# EAGLE schematic v8g (EAGLE 9.0.1)

## Sheet 1 of 4
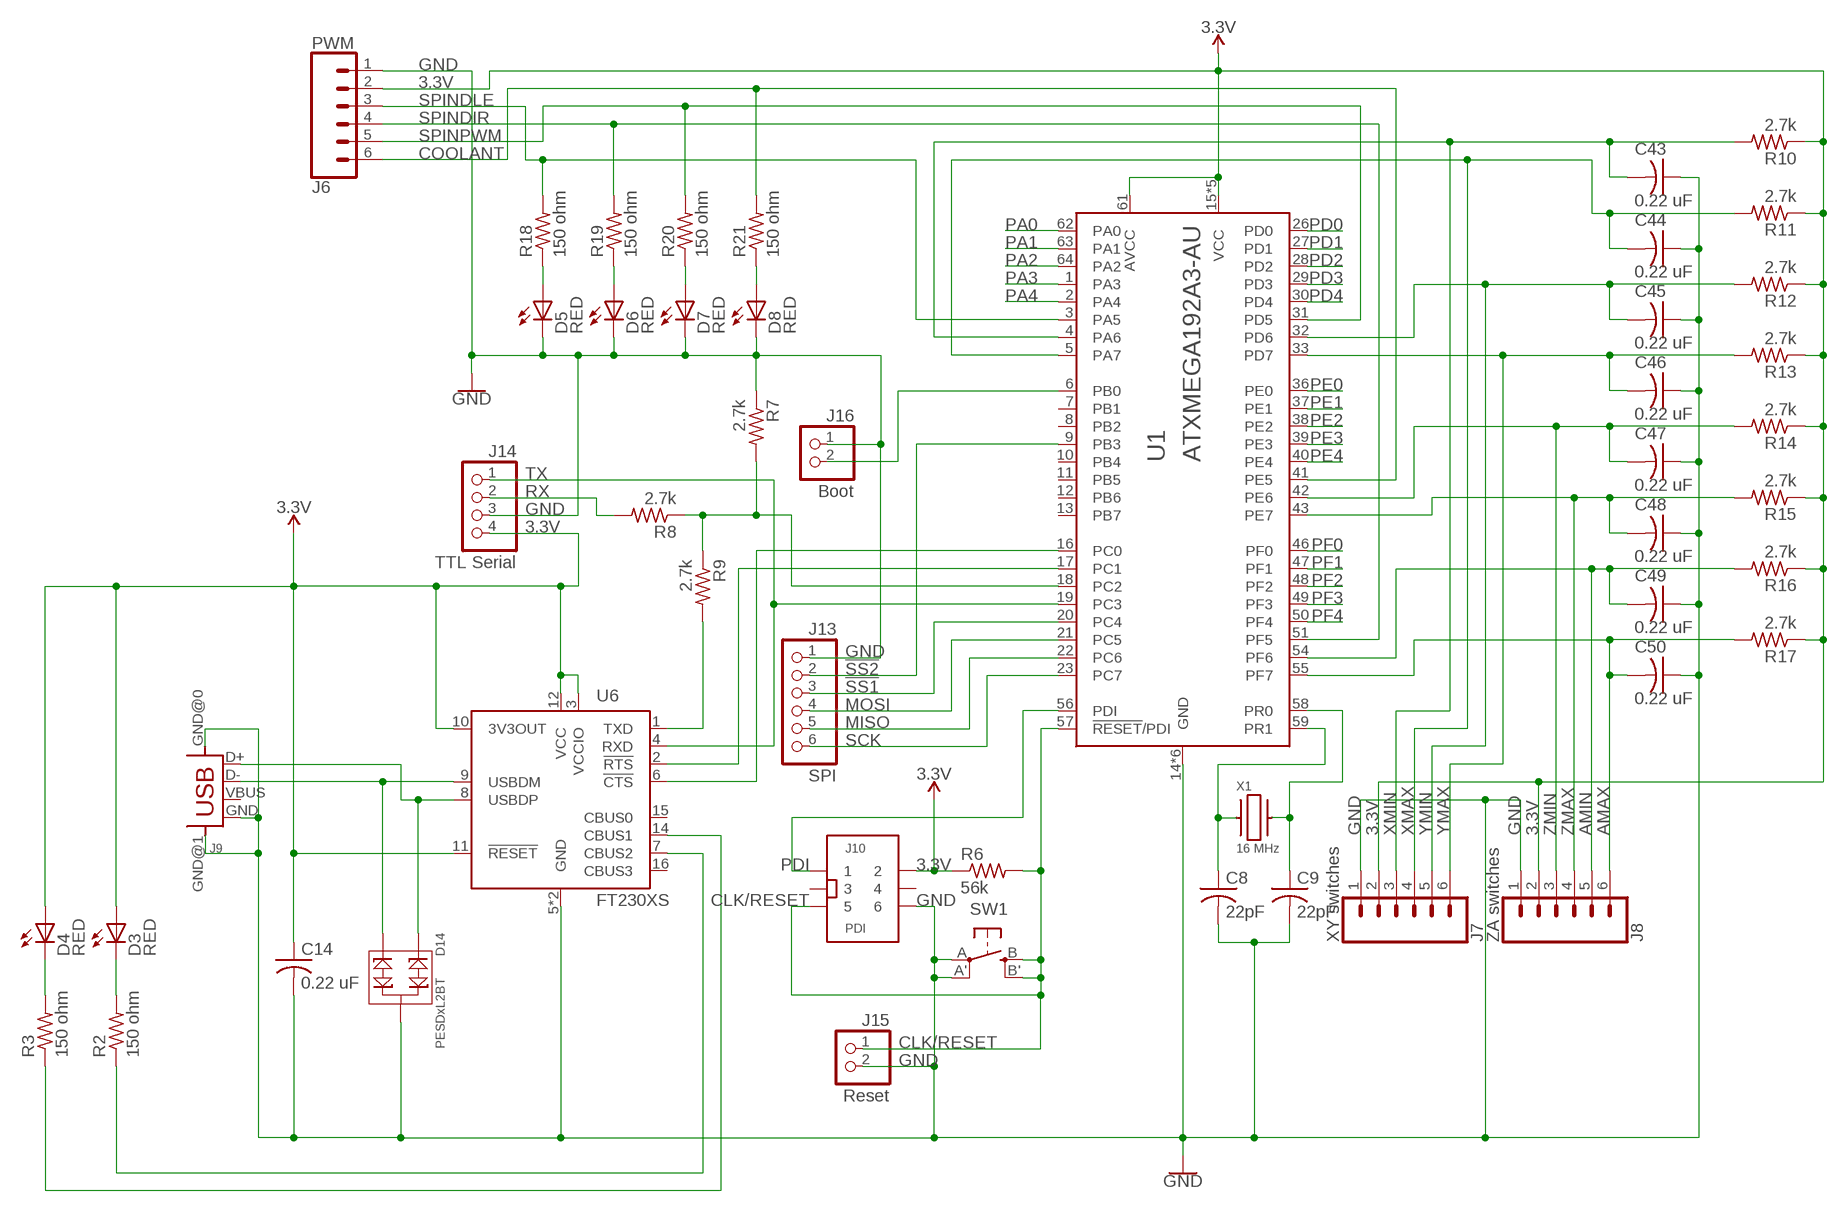
[diagram p0: schematic, sheet 1]

### Parts
C8  22pF  C-USC1206  [C1206]
C9  22pF  C-USC1206  [C1206]
C14  0.22 uF  C-USC1206  [C1206]
C43  0.22 uF  C-USC1206  [C1206]
C44  0.22 uF  C-USC1206  [C1206]
C45  0.22 uF  C-USC1206  [C1206]
C46  0.22 uF  C-USC1206  [C1206]
C47  0.22 uF  C-USC1206  [C1206]
C48  0.22 uF  C-USC1206  [C1206]
C49  0.22 uF  C-USC1206  [C1206]
C50  0.22 uF  C-USC1206  [C1206]
D3  RED  LEDCHIPLED_1206  [CHIPLED_1206]
D4  RED  LEDCHIPLED_1206  [CHIPLED_1206]
D5  RED  LEDCHIPLED_1206  [CHIPLED_1206]
D6  RED  LEDCHIPLED_1206  [CHIPLED_1206]
D7  RED  LEDCHIPLED_1206  [CHIPLED_1206]
D8  RED  LEDCHIPLED_1206  [CHIPLED_1206]
D14  PESDxL2BT  D-ESD-PESDXL2BT  [SOT23]
J6  PWM  CONN_063.5MM-6  [SCREWTERMINAL-3.5MM-6]
J7  XY switches  CONN_063.5MM-6  [SCREWTERMINAL-3.5MM-6]
J8  ZA switches  CONN_063.5MM-6  [SCREWTERMINAL-3.5MM-6]
J9  USB  USB-B-H  [USB-B-H]
J10  PDI  IDC-6-PIN-61200621621  [IDC-6-PIN-61200621621]
J13  SPI  PINHD-1X6  [1X06]
J14  TTL Serial  PINHD-1X4  [1X04]
J15  Reset  PINHD-1X2  [1X02]
J16  Boot  PINHD-1X2  [1X02]
R2  150 ohm  R-US_M1206  [M1206]
R3  150 ohm  R-US_M1206  [M1206]
R6  56k  R-US_M1206  [M1206]
R7  2.7k  R-US_M1206  [M1206]
R8  2.7k  R-US_M1206  [M1206]
R9  2.7k  R-US_M1206  [M1206]
R10  2.7k  R-US_M1206  [M1206]
R11  2.7k  R-US_M1206  [M1206]
R12  2.7k  R-US_M1206  [M1206]
R13  2.7k  R-US_M1206  [M1206]
R14  2.7k  R-US_M1206  [M1206]
R15  2.7k  R-US_M1206  [M1206]
R16  2.7k  R-US_M1206  [M1206]
R17  2.7k  R-US_M1206  [M1206]
R18  150 ohm  R-US_M1206  [M1206]
R19  150 ohm  R-US_M1206  [M1206]
R20  150 ohm  R-US_M1206  [M1206]
R21  150 ohm  R-US_M1206  [M1206]
SW1  SPST_TACT-EVQQ2  [EVQ-Q2]
U1  ATXMEGA192A3-AU  [TQFP-64A-64]
U6  FT230XS  [SSOP16]
X1  16 MHz  C4STSMD  [C4ST-SMD]

### Nets
3.3V: C14.1 D3.A D4.A J6.2 J7.2 J8.2 J10.2 J14.4 R6.1 R10.1 R11.1 R12.1 R13.1 R14.1 R15.1 R16.1 R17.1 U1.15(VCC) U1.25(VCC) U1.35(VCC) U1.45(VCC) U1.53(VCC) U1.61(AVCC) U6.3(VCCIO) U6.10(3V3OUT) U6.11(!RESET) U6.12(VCC) ; also sheet 2,3,4
!SS1: J13.3 U1.20(PC4)
!SS2: J13.2 U1.9(PB3)
AMAX: C50.2 J8.6 R17.2 U1.55(PF7)
AMIN: C49.2 J8.5 R16.2 U1.54(PF6)
CLK/RESET: J10.5 J15.1 R6.2 SW1.B'(S1) SW1.B(S) U1.57(!RESET!/PDI)
COOLANT: J6.6 R21.2 U1.41(PE5)
GND: C8.2 C9.2 C14.2 C43.1 C44.1 C45.1 C46.1 C47.1 C48.1 C49.1 C50.1 D5.C D6.C D7.C D8.C D14.3 J6.1 J7.1 J8.1 J9.GND J9.GND@0(GND) J9.GND@1(GND) J10.6 J13.1 J14.3 J15.2 J16.1 R7.1 SW1.A'(P1) SW1.A(P) U1.14(GND) U1.24(GND) U1.34(GND) U1.44(GND) U1.52(GND) U1.60(GND) U6.5(GND) U6.13(GND) ; also sheet 2,3,4
MISO: J13.5 U1.22(PC6)
MOSI: J13.4 U1.21(PC5)
N$1: R9.2 U6.1(TXD)
N$2: D14.2 J9.D- U6.9(USBDM)
N$4: R3.1 U6.14(CBUS1)
N$6: J16.2 U1.6(PB0)
N$7: D5.A R18.1
N$8: D6.A R19.1
N$9: D7.A R20.1
N$10: D8.A R21.1
N$11: R2.1 U6.7(CBUS2)
N$12: U1.16(PC0) U6.6(!CTS)
N$13: U1.17(PC1) U6.2(!RTS)
N$14: R7.2 R8.1 R9.1 U1.18(PC2)
N$15: D14.1 J9.D+ U6.8(USBDP)
N$17: D3.C R2.2
N$18: D4.C R3.2
N$68: C8.1 U1.59(PR1) X1.1
N$69: C9.1 U1.58(PR0) X1.2
PA0: U1.62(PA0) ; also sheet 3
PA1: U1.63(PA1) ; also sheet 3
PA2: U1.64(PA2) ; also sheet 3
PA3: U1.1(PA3) ; also sheet 3
PA4: U1.2(PA4) ; also sheet 3
PD0: U1.26(PD0) ; also sheet 4
PD1: U1.27(PD1) ; also sheet 4
PD2: U1.28(PD2) ; also sheet 4
PD3: U1.29(PD3) ; also sheet 4
PD4: U1.30(PD4) ; also sheet 4
PDI: J10.1 U1.56(PDI)
PE0: U1.36(PE0) ; also sheet 4
PE1: U1.37(PE1) ; also sheet 4
PE2: U1.38(PE2) ; also sheet 4
PE3: U1.39(PE3) ; also sheet 4
PE4: U1.40(PE4) ; also sheet 4
PF0: U1.46(PF0) ; also sheet 3
PF1: U1.47(PF1) ; also sheet 3
PF2: U1.48(PF2) ; also sheet 3
PF3: U1.49(PF3) ; also sheet 3
PF4: U1.50(PF4) ; also sheet 3
RX: J14.2 R8.2
SCK: J13.6 U1.23(PC7)
SPINDIR: J6.4 R19.2 U1.51(PF5)
SPINDLE: J6.3 R18.2 U1.3(PA5)
SPINPWM: J6.5 R20.2 U1.31(PD5)
TX: J14.1 U1.19(PC3) U6.4(RXD)
XMAX: C44.2 J7.4 R11.2 U1.5(PA7)
XMIN: C43.2 J7.3 R10.2 U1.4(PA6)
YMAX: C46.2 J7.6 R13.2 U1.33(PD7)
YMIN: C45.2 J7.5 R12.2 U1.32(PD6)
ZMAX: C48.2 J8.4 R15.2 U1.43(PE7)
ZMIN: C47.2 J8.3 R14.2 U1.42(PE6)
Unconnected: J9.VBUS J10.3 J10.4 U1.7(PB1) U1.8(PB2) U1.10(PB4) U1.11(PB5) U1.12(PB6) U1.13(PB7) U6.15(CBUS0) U6.16(CBUS3)

## Sheet 2 of 4
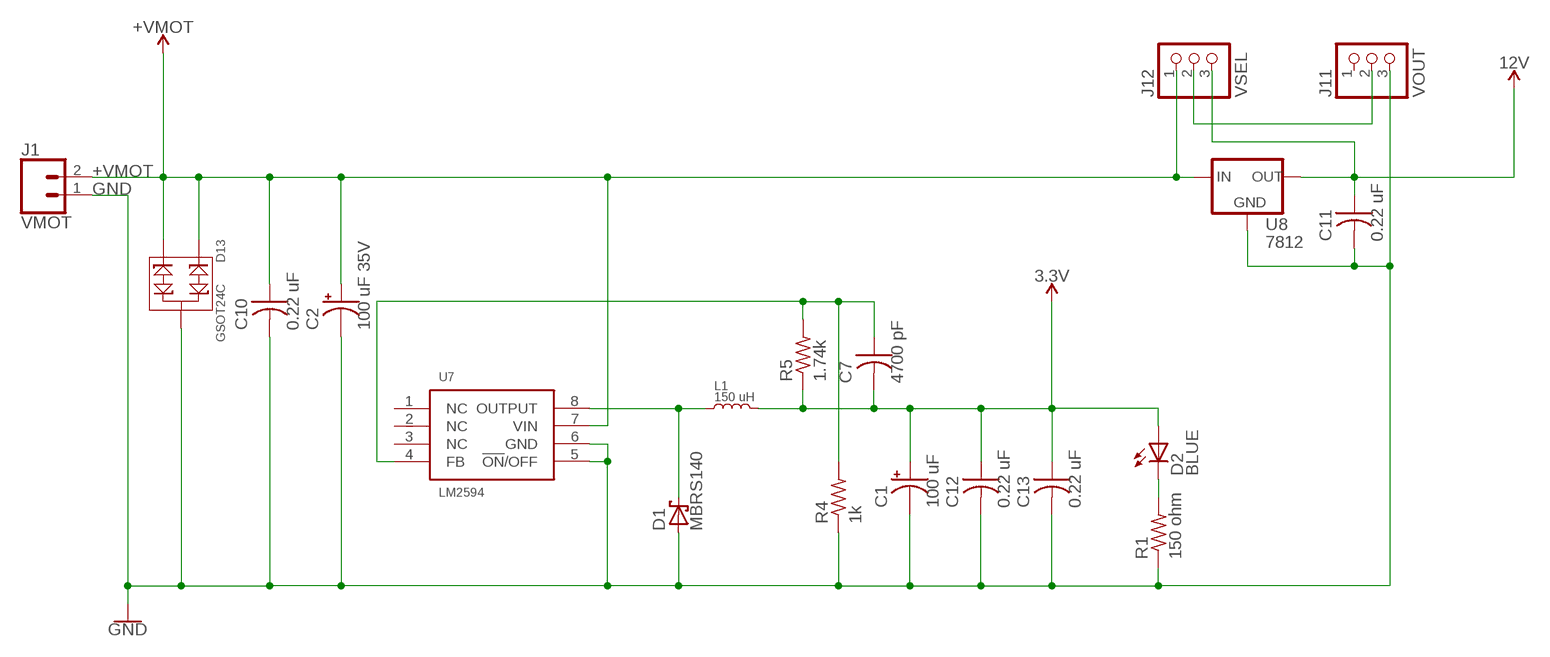
[diagram p1: schematic, sheet 2]

### Parts
C1  100 uF  CPOL-US  [WCAP-ASLI]
C2  100 uF 35V  CPOL-US  [WCAP-ASLI]
C7  4700 pF  C-USC1206  [C1206]
C10  0.22 uF  C-USC1206  [C1206]
C11  0.22 uF  C-USC1206  [C1206]
C12  0.22 uF  C-USC1206  [C1206]
C13  0.22 uF  C-USC1206  [C1206]
D1  MBRS140  SHOTTKY-DIODESMBRS140  [DO-214AA]
D2  BLUE  LEDCHIPLED_1206  [CHIPLED_1206]
D13  GSOT24C  D-ESD-PESDXL2BT  [SOT23]
J1  VMOT  CONN_025MM  [SCREWTERMINAL-5MM-2]
J11  VOUT  PINHD-1X3  [1X03]
J12  VSEL  PINHD-1X3  [1X03]
L1  150 uH  SDE0805A-471K  [SDE0805A]
R1  150 ohm  R-US_R1206  [R1206]
R4  1k  R-US_R1206  [R1206]
R5  1.74k  R-US_R1206  [R1206]
U7  LM2594  [SOIC-8_NB]
U8  7812  L78XXD2TT  [D2PAK]

### Nets
3.3V: C1.+ C7.2 C12.1 C13.1 D2.A L1.2 R5.1 ; also sheet 1,3,4
12V: C11.1 J12.3 U8.3(OUT)
+VMOT: C2.+ C10.1 D13.1 D13.2 J1.2 J12.1 U7.7(VIN) U8.1(IN) ; also sheet 3,4
GND: C1.- C2.- C10.2 C11.2 C12.2 C13.2 D1.A D13.3 J1.1 J11.3 R1.1 R4.1 U7.5(!ON!/OFF) U7.6(GND) U8.2(GND) ; also sheet 1,3,4
N$3: D2.C R1.2
N$16: J11.2 J12.2
N$21: D1.C L1.1 U7.8(OUTPUT)
N$23: C7.1 R4.2 R5.2 U7.4(FB)
Unconnected: J11.1 U7.1(NC) U7.2(NC) U7.3(NC)

## Sheet 3 of 4
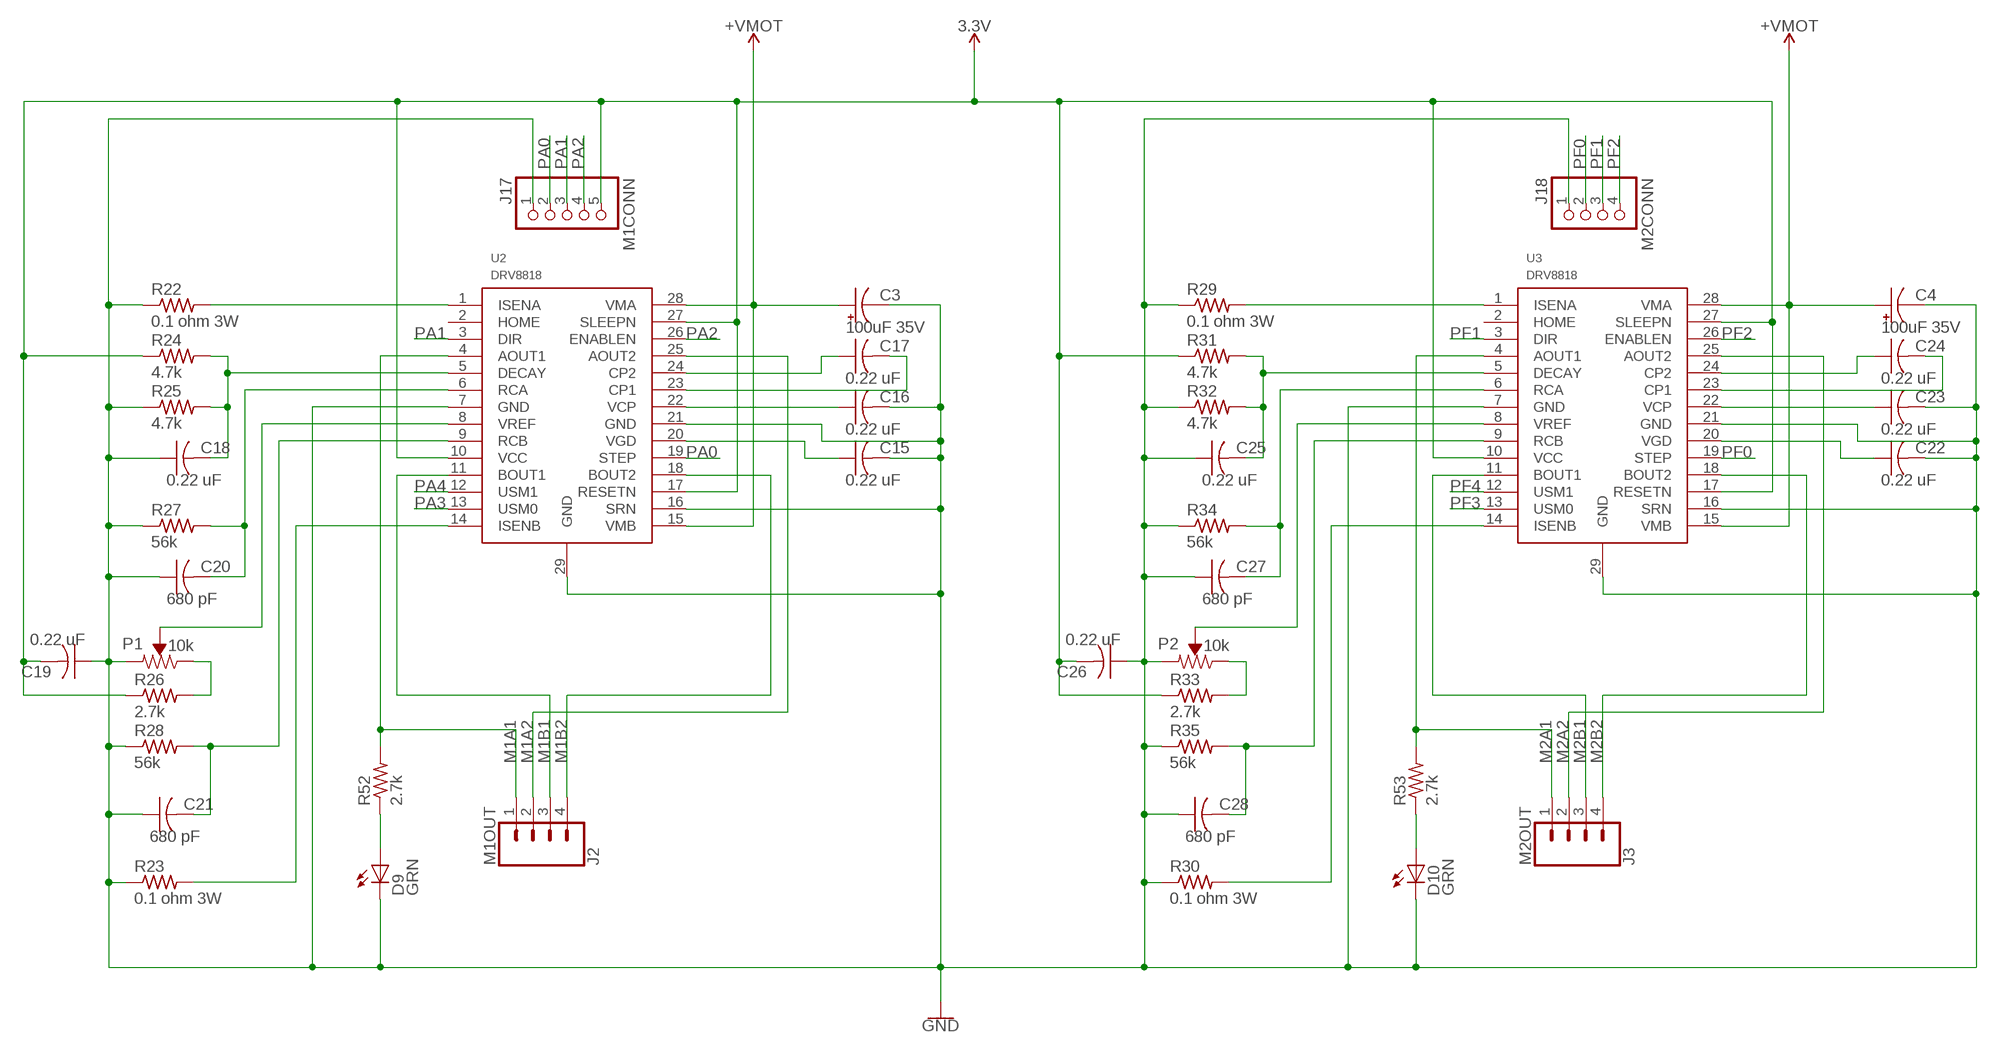
[diagram p2: schematic, sheet 3]

### Parts
C3  100uF 35V  CPOL-US  [WCAP-ASLI]
C4  100uF 35V  CPOL-US  [WCAP-ASLI]
C15  0.22 uF  C-USC1206  [C1206]
C16  0.22 uF  C-USC1206  [C1206]
C17  0.22 uF  C-USC1206  [C1206]
C18  0.22 uF  C-USC1206  [C1206]
C19  0.22 uF  C-USC1206  [C1206]
C20  680 pF  C-USC1206  [C1206]
C21  680 pF  C-USC1206  [C1206]
C22  0.22 uF  C-USC1206  [C1206]
C23  0.22 uF  C-USC1206  [C1206]
C24  0.22 uF  C-USC1206  [C1206]
C25  0.22 uF  C-USC1206  [C1206]
C26  0.22 uF  C-USC1206  [C1206]
C27  680 pF  C-USC1206  [C1206]
C28  680 pF  C-USC1206  [C1206]
D9  GRN  LEDCHIPLED_1206  [CHIPLED_1206]
D10  GRN  LEDCHIPLED_1206  [CHIPLED_1206]
J2  M1OUT  CONN_04SCREW  [SCREWTERMINAL-3.5MM-4]
J3  M2OUT  CONN_04SCREW  [SCREWTERMINAL-3.5MM-4]
J17  M1CONN  PINHD-1X5  [1X05]
J18  M2CONN  PINHD-1X4  [1X04]
P1  10k  TRIMPOT  [BOURNS_3361P]
P2  10k  TRIMPOT  [BOURNS_3361P]
R22  0.1 ohm 3W  R-US_R2512  [R2512]
R23  0.1 ohm 3W  R-US_R2512  [R2512]
R24  4.7k  R-US_R1206  [R1206]
R25  4.7k  R-US_R1206  [R1206]
R26  2.7k  R-US_R1206  [R1206]
R27  56k  R-US_R1206  [R1206]
R28  56k  R-US_R1206  [R1206]
R29  0.1 ohm 3W  R-US_R2512  [R2512]
R30  0.1 ohm 3W  R-US_R2512  [R2512]
R31  4.7k  R-US_R1206  [R1206]
R32  4.7k  R-US_R1206  [R1206]
R33  2.7k  R-US_R1206  [R1206]
R34  56k  R-US_R1206  [R1206]
R35  56k  R-US_R1206  [R1206]
R52  2.7k  R-US_0207/7  [0207/7]
R53  2.7k  R-US_0207/7  [0207/7]
U2  DRV8818  [HTSSOP_28-PIN]
U3  DRV8818  [HTSSOP_28-PIN]

### Nets
3.3V: C19.2 C26.2 J17.5 R24.1 R26.1 R31.1 R33.1 U2.10(VCC) U2.17(RESETN) U2.27(SLEEPN) U3.10(VCC) U3.17(RESETN) U3.27(SLEEPN) ; also sheet 1,2,4
+VMOT: C3.+ C4.+ U2.15(VMB) U2.28(VMA) U3.15(VMB) U3.28(VMA) ; also sheet 2,4
GND: C3.- C4.- C15.2 C16.2 C18.1 C19.1 C20.1 C21.1 C22.2 C23.2 C25.1 C26.1 C27.1 C28.1 D9.C D10.C J17.1 J18.1 P1.1 P2.1 R22.1 R23.1 R25.1 R27.1 R28.1 R29.1 R30.1 R32.1 R34.1 R35.1 U2.7(GND) U2.16(SRN) U2.21(GND) U2.29(GND) U3.7(GND) U3.16(SRN) U3.21(GND) U3.29(GND) ; also sheet 1,2,4
M1A1: J2.1 R52.2 U2.4(AOUT1)
M1A2: J2.2 U2.25(AOUT2)
M1B1: J2.3 U2.11(BOUT1)
M1B2: J2.4 U2.18(BOUT2)
M2A1: J3.1 R53.2 U3.4(AOUT1)
M2A2: J3.2 U3.25(AOUT2)
M2B1: J3.3 U3.11(BOUT1)
M2B2: J3.4 U3.18(BOUT2)
N$5: D9.A R52.1
N$19: R22.2 U2.1(ISENA)
N$20: P1.2 U2.8(VREF)
N$22: C17.1 U2.24(CP2)
N$24: P1.3 R26.2
N$25: C17.2 U2.23(CP1)
N$27: C18.2 R24.2 R25.2 U2.5(DECAY)
N$28: C20.2 R27.2 U2.6(RCA)
N$30: C21.2 R28.2 U2.9(RCB)
N$31: R23.2 U2.14(ISENB)
N$32: C16.1 U2.22(VCP)
N$34: C15.1 U2.20(VGD)
N$38: R29.2 U3.1(ISENA)
N$39: C25.2 R31.2 R32.2 U3.5(DECAY)
N$40: C27.2 R34.2 U3.6(RCA)
N$42: P2.2 U3.8(VREF)
N$43: P2.3 R33.2
N$44: C28.2 R35.2 U3.9(RCB)
N$45: R30.2 U3.14(ISENB)
N$46: D10.A R53.1
N$47: C24.2 U3.23(CP1)
N$48: C23.1 U3.22(VCP)
N$49: C22.1 U3.20(VGD)
N$50: C24.1 U3.24(CP2)
PA0: J17.2 U2.19(STEP) ; also sheet 1
PA1: J17.3 U2.3(DIR) ; also sheet 1
PA2: J17.4 U2.26(ENABLEN) ; also sheet 1
PA3: U2.13(USM0) ; also sheet 1
PA4: U2.12(USM1) ; also sheet 1
PF0: J18.2 U3.19(STEP) ; also sheet 1
PF1: J18.3 U3.3(DIR) ; also sheet 1
PF2: J18.4 U3.26(ENABLEN) ; also sheet 1
PF3: U3.13(USM0) ; also sheet 1
PF4: U3.12(USM1) ; also sheet 1
Unconnected: U2.2(HOME) U3.2(HOME)

## Sheet 4 of 4
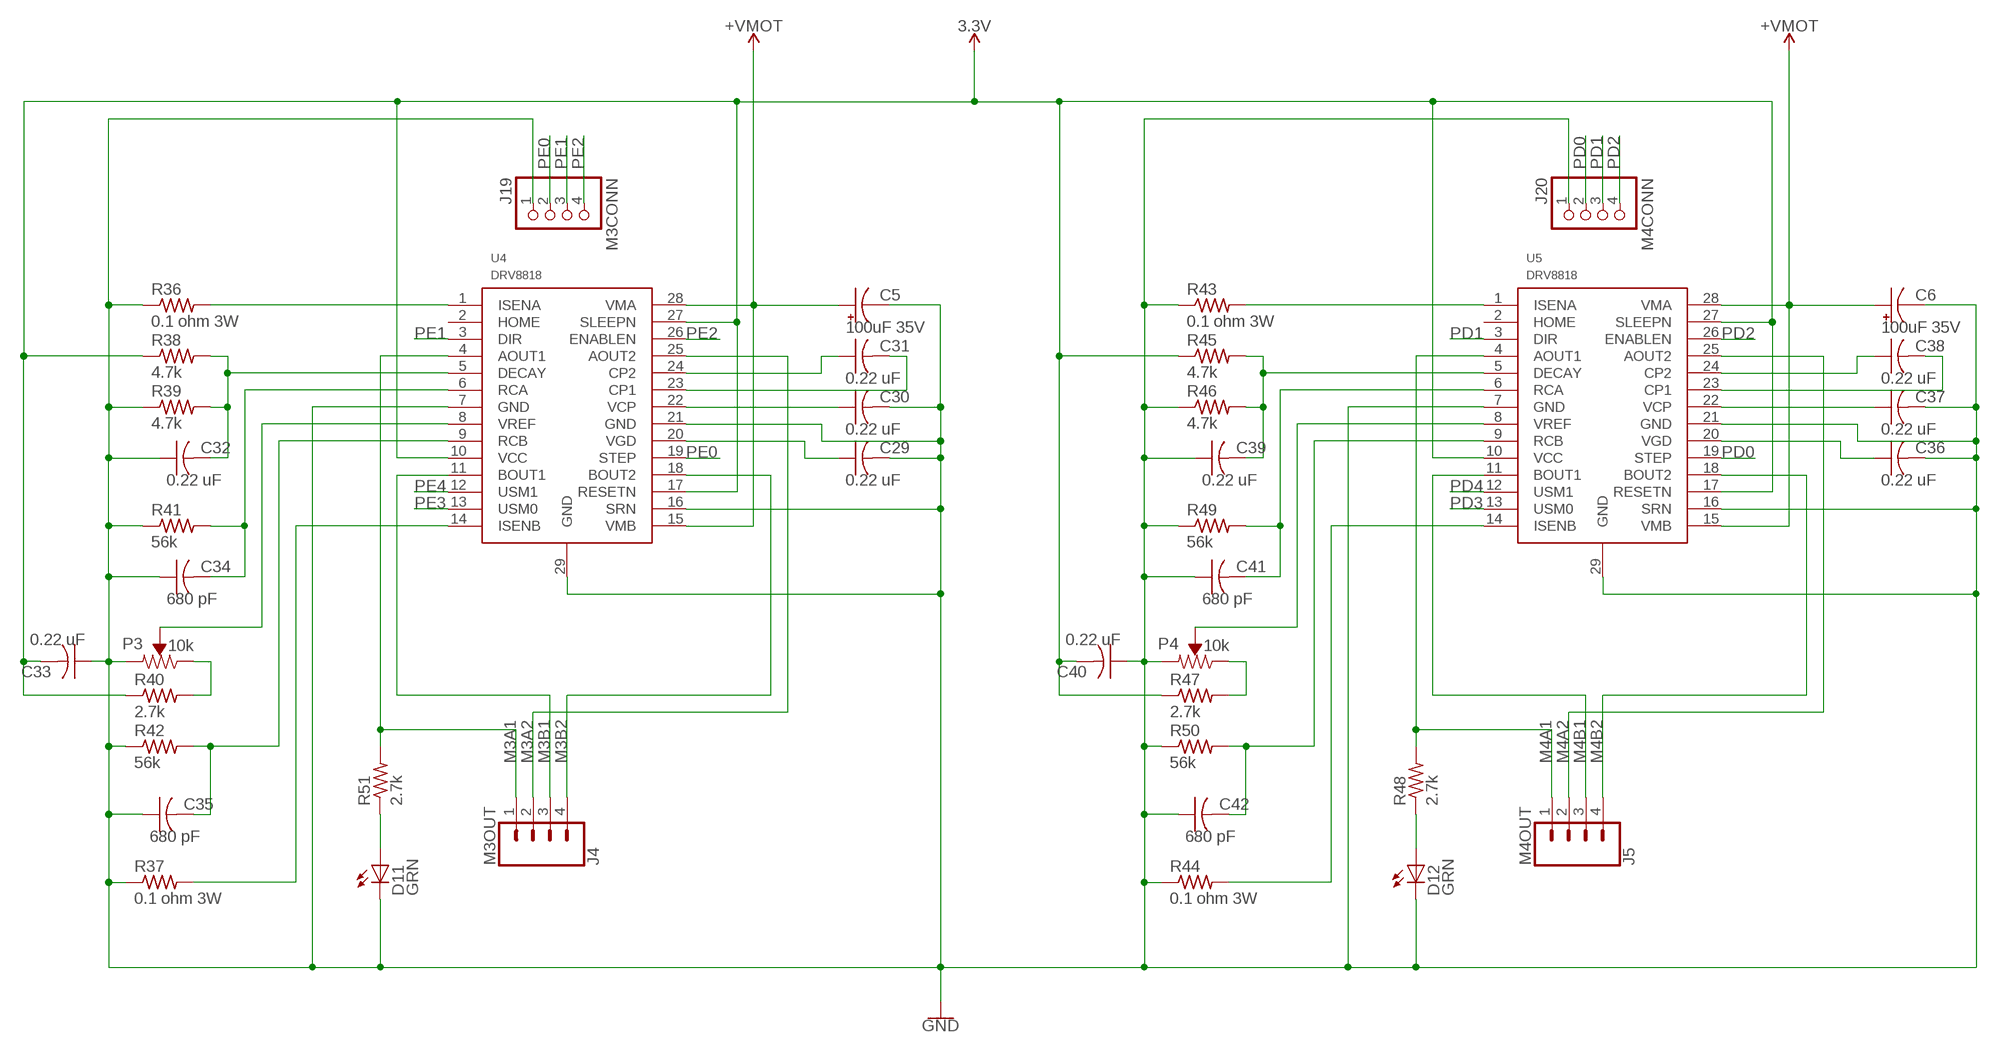
[diagram p3: schematic, sheet 4]

### Parts
C5  100uF 35V  CPOL-US  [WCAP-ASLI]
C6  100uF 35V  CPOL-US  [WCAP-ASLI]
C29  0.22 uF  C-USC1206  [C1206]
C30  0.22 uF  C-USC1206  [C1206]
C31  0.22 uF  C-USC1206  [C1206]
C32  0.22 uF  C-USC1206  [C1206]
C33  0.22 uF  C-USC1206  [C1206]
C34  680 pF  C-USC1206  [C1206]
C35  680 pF  C-USC1206  [C1206]
C36  0.22 uF  C-USC1206  [C1206]
C37  0.22 uF  C-USC1206  [C1206]
C38  0.22 uF  C-USC1206  [C1206]
C39  0.22 uF  C-USC1206  [C1206]
C40  0.22 uF  C-USC1206  [C1206]
C41  680 pF  C-USC1206  [C1206]
C42  680 pF  C-USC1206  [C1206]
D11  GRN  LEDCHIPLED_1206  [CHIPLED_1206]
D12  GRN  LEDCHIPLED_1206  [CHIPLED_1206]
J4  M3OUT  CONN_04SCREW  [SCREWTERMINAL-3.5MM-4]
J5  M4OUT  CONN_04SCREW  [SCREWTERMINAL-3.5MM-4]
J19  M3CONN  PINHD-1X4  [1X04]
J20  M4CONN  PINHD-1X4  [1X04]
P3  10k  TRIMPOT  [BOURNS_3361P]
P4  10k  TRIMPOT  [BOURNS_3361P]
R36  0.1 ohm 3W  R-US_R2512  [R2512]
R37  0.1 ohm 3W  R-US_R2512  [R2512]
R38  4.7k  R-US_R1206  [R1206]
R39  4.7k  R-US_R1206  [R1206]
R40  2.7k  R-US_R1206  [R1206]
R41  56k  R-US_R1206  [R1206]
R42  56k  R-US_R1206  [R1206]
R43  0.1 ohm 3W  R-US_R2512  [R2512]
R44  0.1 ohm 3W  R-US_R2512  [R2512]
R45  4.7k  R-US_R1206  [R1206]
R46  4.7k  R-US_R1206  [R1206]
R47  2.7k  R-US_R1206  [R1206]
R48  2.7k  R-US_0207/7  [0207/7]
R49  56k  R-US_R1206  [R1206]
R50  56k  R-US_R1206  [R1206]
R51  2.7k  R-US_0207/7  [0207/7]
U4  DRV8818  [HTSSOP_28-PIN]
U5  DRV8818  [HTSSOP_28-PIN]

### Nets
3.3V: C33.2 C40.2 R38.1 R40.1 R45.1 R47.1 U4.10(VCC) U4.17(RESETN) U4.27(SLEEPN) U5.10(VCC) U5.17(RESETN) U5.27(SLEEPN) ; also sheet 1,2,3
+VMOT: C5.+ C6.+ U4.15(VMB) U4.28(VMA) U5.15(VMB) U5.28(VMA) ; also sheet 2,3
GND: C5.- C6.- C29.2 C30.2 C32.1 C33.1 C34.1 C35.1 C36.2 C37.2 C39.1 C40.1 C41.1 C42.1 D11.C D12.C J19.1 J20.1 P3.1 P4.1 R36.1 R37.1 R39.1 R41.1 R42.1 R43.1 R44.1 R46.1 R49.1 R50.1 U4.7(GND) U4.16(SRN) U4.21(GND) U4.29(GND) U5.7(GND) U5.16(SRN) U5.21(GND) U5.29(GND) ; also sheet 1,2,3
M3A1: J4.1 R51.2 U4.4(AOUT1)
M3A2: J4.2 U4.25(AOUT2)
M3B1: J4.3 U4.11(BOUT1)
M3B2: J4.4 U4.18(BOUT2)
M4A1: J5.1 R48.2 U5.4(AOUT1)
M4A2: J5.2 U5.25(AOUT2)
M4B1: J5.3 U5.11(BOUT1)
M4B2: J5.4 U5.18(BOUT2)
N$26: R36.2 U4.1(ISENA)
N$29: C32.2 R38.2 R39.2 U4.5(DECAY)
N$33: C34.2 R41.2 U4.6(RCA)
N$35: P3.2 U4.8(VREF)
N$36: P3.3 R40.2
N$37: C35.2 R42.2 U4.9(RCB)
N$41: R37.2 U4.14(ISENB)
N$51: D11.A R51.1
N$52: C31.2 U4.23(CP1)
N$53: C30.1 U4.22(VCP)
N$54: C29.1 U4.20(VGD)
N$55: C31.1 U4.24(CP2)
N$56: R43.2 U5.1(ISENA)
N$57: C39.2 R45.2 R46.2 U5.5(DECAY)
N$58: C41.2 R49.2 U5.6(RCA)
N$59: P4.2 U5.8(VREF)
N$60: P4.3 R47.2
N$61: C42.2 R50.2 U5.9(RCB)
N$62: R44.2 U5.14(ISENB)
N$63: D12.A R48.1
N$64: C38.2 U5.23(CP1)
N$65: C37.1 U5.22(VCP)
N$66: C36.1 U5.20(VGD)
N$67: C38.1 U5.24(CP2)
PD0: J20.2 U5.19(STEP) ; also sheet 1
PD1: J20.3 U5.3(DIR) ; also sheet 1
PD2: J20.4 U5.26(ENABLEN) ; also sheet 1
PD3: U5.13(USM0) ; also sheet 1
PD4: U5.12(USM1) ; also sheet 1
PE0: J19.2 U4.19(STEP) ; also sheet 1
PE1: J19.3 U4.3(DIR) ; also sheet 1
PE2: J19.4 U4.26(ENABLEN) ; also sheet 1
PE3: U4.13(USM0) ; also sheet 1
PE4: U4.12(USM1) ; also sheet 1
Unconnected: U4.2(HOME) U5.2(HOME)

## Library data of the parts
C1-C6 = Pamir:CPOL-US
C7-C50 = adafruit:C-US: CAPACITOR, American symbol
D1 = MarcEagleParts:SHOTTKY-DIODES: Shottky Diodes SMT DO-214AA: 1A 40V SMA 403D-02
D2-D12 = adafruit:LED: LED OSRAM: - CHIPLED LG R971, LG N971, LY N971, LG Q971, LY Q971, LO R971, LY R971 LH N974, LH R974 LS Q976, LO Q976, LY Q976 LO Q996 - Hyper CHIPLED LW Q18S LB Q993, LB Q99A, LB R99A - SideLED LS A670, LO A670, LY A670, LG A670, LP A670 LB A673, LV A673, LT A673, LW A673 LH A674 LY A675 LS A676, LA A676, LO A676, LY A676, LW A676 LS A679, LY A679, LG A679 - Hyper Micro SIDELED® LS Y876, LA Y876, LO Y876, LY Y876 LT Y87S - SmartLED LW L88C, LW L88S LB L89C, LB L89S, LG L890 LS L89K, LO L89K, LY L89K LS L896, LA L896, LO L896, LY L896 - TOPLED LS T670, LO T670, LY T670, LG T670, LP T670 LSG T670, LSP T670, LSY T670, LOP T670, LYG T670 LG T671, LOG T671, LSG T671 LB T673, LV T673, LT T673, LW T673 LH T674 LS T676, LA T676, LO T676, LY T676, LB T676, LH T676, LSB T676, LW T676 LB T67C, LV T67C, LT T67C, LS T67K, LO T67K, LY T67K, LW E67C LS E67B, LA E67B, LO E67B, LY E67B, LB E67C, LV E67C, LT E67C LW T67C LS T679, LY T679, LG T679 LS T770, LO T770, LY T770, LG T770, LP T770 LB T773, LV T773, LT T773, LW T773 LH T774 LS E675, LA E675, LY E675, LS T675 LS T776, LA T776, LO T776, LY T776, LB T776 LHGB T686 LT T68C, LB T68C - Hyper Mini TOPLED® LB M676 - Mini TOPLED Santana® LG M470 LS M47K, LO M47K, LY M47K Source: http://www.osram.convergy.de/
D13 D14 = discrete:D-ESD-PESDXL2BT
J1 = SparkFun-Connectors:CONN_02: Multi connection point. Often used as Generic Header-pin footprint for 0.1 inch spaced/style header connections On any of the 0.1 inch spaced packages, you can populate with these: Break Away Headers - Straight <https://www.sparkfun.com/products/116> (PRT-00116) Break Away Male Headers - Right Angle <https://www.sparkfun.com/products/553> (PRT-00553) Female Headers <https://www.sparkfun.com/products/115> (PRT-00115) Break Away Headers - Machine Pin <https://www.sparkfun.com/products/117> (PRT-00117) Break Away Female Headers - Swiss Machine Pin <https://www.sparkfun.com/products/743> (PRT-00743) For SCREWTERMINALS and SPRING TERMINALS visit here: Screw Terimnals on SparkFun.com <https://www.sparkfun.com/search/results?term=Screw+Terminals> (5mm/3.5mm/2.54mm spacing) This device is also useful as a general connection point to wire up your design to another part of your project. Our various solder wires solder well into these plated through hole pads. Hook-Up Wire - Assortment (Stranded, 22 AWG) <https://www.sparkfun.com/products/11375> (PRT-11375) Hook-Up Wire - Assortment (Solid Core, 22 AWG) <https://www.sparkfun.com/products/11367> (PRT-11367) View the entire wire category on our website here <https://www.sparkfun.com/categories/141> Special notes: Molex polarized connector foot print use with: PRT-08233 with associated crimp pins and housings. 2.54_SCREWTERM for use with PRT-10571. 3.5mm Screw Terminal footprints for PRT-08084 5mm Screw Terminal footprints for use with PRT-08432; SF_SKU: PRT-08432
J2-J5 = SparkFun-Connectors:CONN_04: Multi connection point. Often used as Generic Header-pin footprint for 0.1 inch spaced/style header connections On any of the 0.1 inch spaced packages, you can populate with these: Break Away Headers - Straight <https://www.sparkfun.com/products/116> (PRT-00116) Break Away Male Headers - Right Angle <https://www.sparkfun.com/products/553> (PRT-00553) Female Headers <https://www.sparkfun.com/products/115> (PRT-00115) Break Away Headers - Machine Pin <https://www.sparkfun.com/products/117> (PRT-00117) Break Away Female Headers - Swiss Machine Pin <https://www.sparkfun.com/products/743> (PRT-00743) For SCREWTERMINALS and SPRING TERMINALS visit here: Screw Terimnals on SparkFun.com <https://www.sparkfun.com/search/results?term=Screw+Terminals> (5mm/3.5mm/2.54mm spacing) This device is also useful as a general connection point to wire up your design to another part of your project. Our various solder wires solder well into these plated through hole pads. Hook-Up Wire - Assortment (Stranded, 22 AWG) <https://www.sparkfun.com/products/11375> (PRT-11375) Hook-Up Wire - Assortment (Solid Core, 22 AWG) <https://www.sparkfun.com/products/11367> (PRT-11367) View the entire wire category on our website here <https://www.sparkfun.com/categories/141> Special notes: Molex polarized connector foot print use with SKU : PRT-08231 with associated crimp pins and housings. 1MM SMD Version SKU: PRT-10208; PROD_ID: 2xCONN-08399; SF_ID: 2xPRT-08084
J6-J8 = SparkFun-Connectors:CONN_06: Multi connection point. Often used as Generic Header-pin footprint for 0.1 inch spaced/style header connections On any of the 0.1 inch spaced packages, you can populate with these: Break Away Headers - Straight <https://www.sparkfun.com/products/116> (PRT-00116) Break Away Male Headers - Right Angle <https://www.sparkfun.com/products/553> (PRT-00553) Female Headers <https://www.sparkfun.com/products/115> (PRT-00115) Break Away Headers - Machine Pin <https://www.sparkfun.com/products/117> (PRT-00117) Break Away Female Headers - Swiss Machine Pin <https://www.sparkfun.com/products/743> (PRT-00743) Arduino Stackable Header - 6 Pin <https://www.sparkfun.com/products/9280> (PRT-09280) For SCREWTERMINALS and SPRING TERMINALS visit here: Screw Terimnals on SparkFun.com <https://www.sparkfun.com/search/results?term=Screw+Terminals> (5mm/3.5mm/2.54mm spacing) This device is also useful as a general connection point to wire up your design to another part of your project. Our various solder wires solder well into these plated through hole pads. Hook-Up Wire - Assortment (Stranded, 22 AWG) <https://www.sparkfun.com/products/11375> (PRT-11375) Hook-Up Wire - Assortment (Solid Core, 22 AWG) <https://www.sparkfun.com/products/11367> (PRT-11367) View the entire wire category on our website here <https://www.sparkfun.com/categories/141>
J9 = Pamir:USB: USB Connectors
J10 = Pamir:IDC-6-PIN-61200621621: Box Header IDC Conn WR-BHD 61200621621 - Box Header_IDC Conn WR-BHD Manufacturer: Wurth Electronics Inc. Manufacturer Part Number: 61200621621 Description: CONN HEADER 6POS 2.54 Technical Specifications: N/A Digikey: 732-5394-ND Mouser: N/A
J11 J12 = adafruit:PINHD-1X3: PIN HEADER
J13 = pinhead:PINHD-1X6: PIN HEADER
J14 J18-J20 = pinhead:PINHD-1X4: PIN HEADER
J15 J16 = pinhead:PINHD-1X2: PIN HEADER
J17 = pinhead:PINHD-1X5: PIN HEADER
L1 = Bourns:SDE0805A
P1-P4 = Pamir:TRIMPOT: Trimming Potentiometer (Trimpot) Three-terminal potentiometers, with an adjustable wiper and two adjustable resistors. A pot can be used to create a configurable voltage divider, or as a variable resistor. "Trimpots" are a subset of potentiometers, usually intended for "set-and-forget" applications. They're often more delicate than standard potentiometers - rated for fewer turns. Variants PTH-KNOB - PTH Trimpot w/ finger-adjustable knob Trimpot 10K with Knob <https://www.sparkfun.com/products/9806> (COM-09806) Datasheet <http://www.sparkfun.com/datasheets/Components/General/TSR-3386.pdf> SMD-3MM-CLOSED-FRAME - SMD 3mm Square Closed-Frame Trimpot Used on e.g. EasyDriver - Stepper Motor Driver <https://www.sparkfun.com/products/12779> Datasheet <http://www.bitechnologies.com/pdfs/22.pdf> (22AR10KTR) SMD-5MM - SMD 5mm Square Closed-Frame Trimpot Used on e.g. IOIO-OTG - V2.2 <https://www.sparkfun.com/products/13613> Datasheet <http://www.vishay.com/docs/51008/ts53.pdf> (TS53YL502MR10) SMD-3MM-1/10W-25% - 3mm Square Open-Frame Trimpot Used on e.g. SparkFun Shapeoko <https://www.sparkfun.com/products/13899> Datasheet <http://www.bourns.com/docs/Product-Datasheets/TC33.pdf> (TC33X-2-103E)
R1-R53 = adafruit:R-US_: RESISTOR, American symbol
SW1 = adafruit:SPST_TACT: SMT 6mm switch, EVQQ2 series http://www.ladyada.net/library/eagle
U1 = Pamir:ATXMEGA192A3: 8/16-bit XMEGA A3 Microcontroller Features High-performance, Low-power 8/16-bit Atmel® AVR® XMEGATM Microcontroller Non-volatile Program and Data Memories – 64 KB - 256 KB of In-System Self-Programmable Flash – 4 KB - 8 KB Boot Code Section with Independent Lock Bits – 2 KB - 4 KB EEPROM – 4 KB - 16 KB Internal SRAM Peripheral Features – Four-channel DMA Controller with support for external requests – Eight-channel Event System – Seven 16-bit Timer/Counters Four Timer/Counters with 4 Output Compare or Input Capture channels Three Timer/Counters with 2 Output Compare or Input Capture channels High Resolution Extensions on all Timer/Counters Advanced Waveform Extension on one Timer/Counter – Seven USARTs IrDA Extension on 1 USART – AES and DES Crypto Engine – Two Two-wire Interfaces with dual address match (I2C and SMBus compatible) – Three SPI (Serial Peripheral Interfaces) – 16-bit Real Time Counter with Separate Oscillator – Two Eight-channel, 12-bit, 2 Msps Analog to Digital Converters – One Two-channel, 12-bit, 1 Msps Digital to Analog Converter – Four Analog Comparators with Window compare function – External Interrupts on all General Purpose I/O pins – Programmable Watchdog Timer with Separate On-chip Ultra Low Power Oscillator Special Microcontroller Features – Power-on Reset and Programmable Brown-out Detection – Internal and External Clock Options with PLL – Programmable Multi-level Interrupt Controller – Sleep Modes: Idle, Power-down, Standby, Power-save, Extended Standby – Advanced Programming, Test and Debugging Interfaces JTAG (IEEE 1149.1 Compliant) Interface for test, debug and programming PDI (Program and Debug Interface) for programming, test and debugging I/O and Packages – 50 Programmable I/O Lines – 64-lead TQFP – 64-pad QFN Operating Voltage – 1.6 – 3.6V Speed performance – 0 – 12 MHz @ 1.6 – 3.6V – 0 – 32 MHz @ 2.7 – 3.6V
U2-U5 = Pamir:DRV8818
U6 = ft230x_10:FT230X: USB to Basic UART IC Source: http://www.ftdichip.com/Support/Documents/DataSheets/ICs/DS_FT230X.pdf; MF: FTDI; MPN: FT230XS; OC_FARNELL: 2081321; OC_NEWARK: 83T7087
U7 = Pamir:LM2594
U8 = v-reg:L78XX: VOLTAGE REGULATOR
X1 = Pamir:C4ST